# Altium project RyuBoard v2.0.PrjPcb
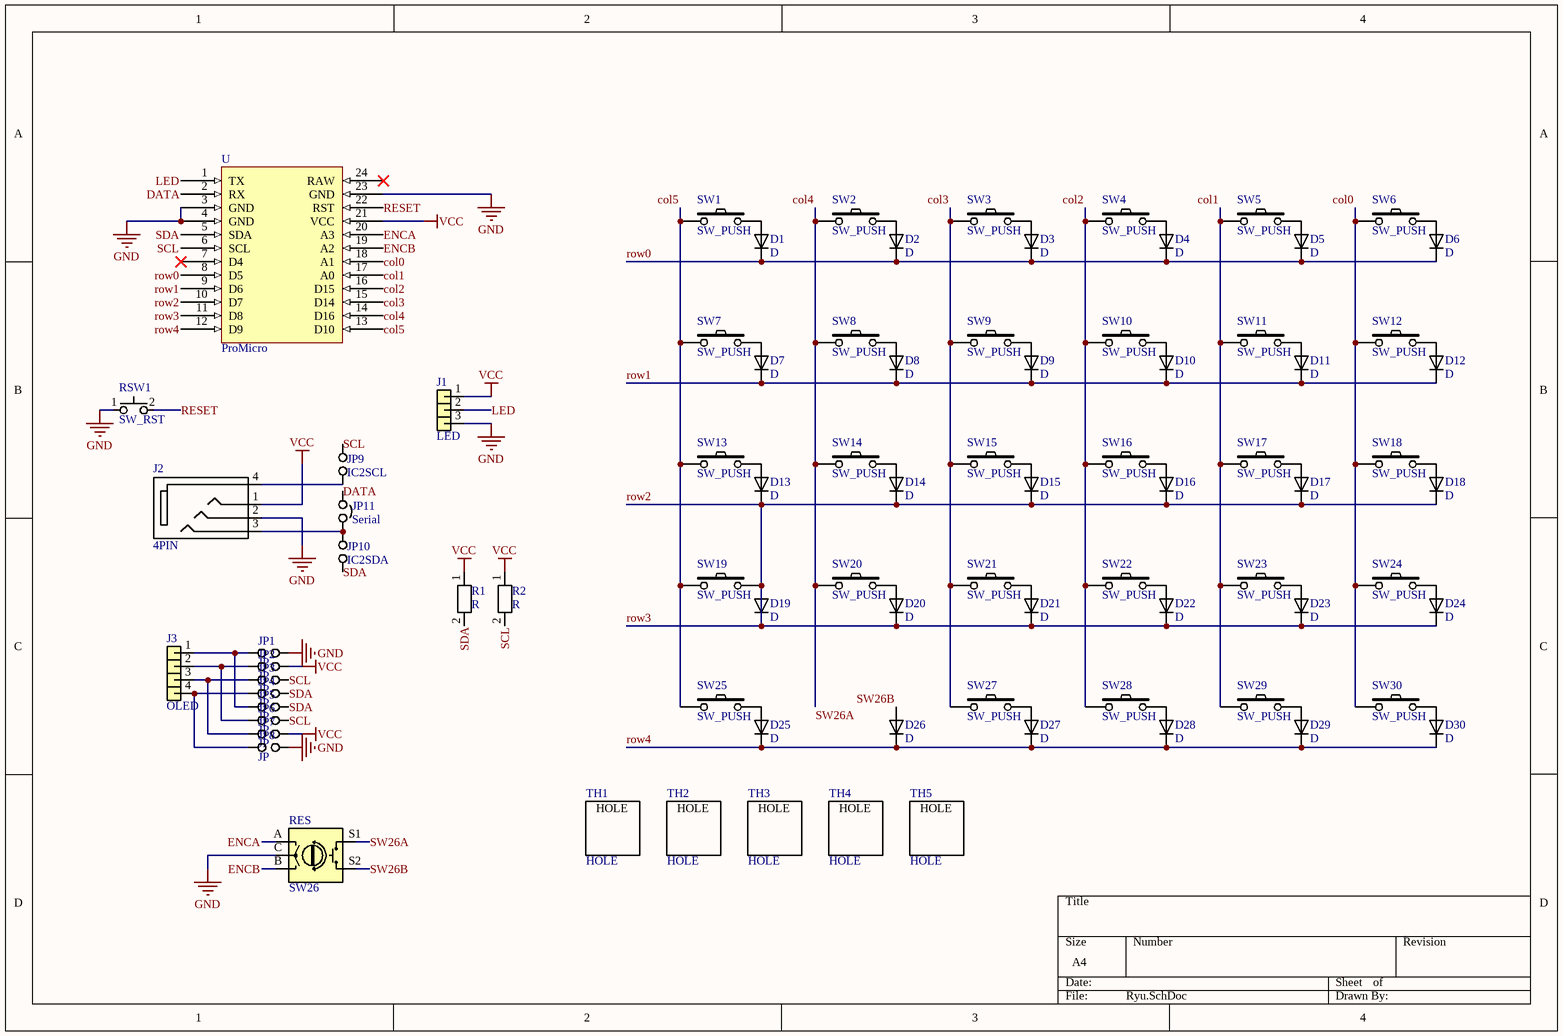
[diagram p0: Ryu.SchDoc]
1 sheet, 83 parts. Net scope: global (net labels, ports and power ports of the same name join across sheets).
Board file: Ryu.PcbDoc

## Sheet Ryu.SchDoc
size A4; SheetNumber: 1; SheetTotal: 1

### Parts
D1  D  [D_SOD123]
D2  D  [D_SOD123]
D3  D  [D_SOD123]
D4  D  [D_SOD123]
D5  D  [D_SOD123]
D6  D  [D_SOD123]
D7  D  [D_SOD123]
D8  D  [D_SOD123]
D9  D  [D_SOD123]
D10  D  [D_SOD123]
D11  D  [D_SOD123]
D12  D  [D_SOD123]
D13  D  [D_SOD123]
D14  D  [D_SOD123]
D15  D  [D_SOD123]
D16  D  [D_SOD123]
D17  D  [D_SOD123]
D18  D  [D_SOD123]
D19  D  [D_SOD123]
D20  D  [D_SOD123]
D21  D  [D_SOD123]
D22  D  [D_SOD123]
D23  D  [D_SOD123]
D24  D  [D_SOD123]
D25  D  [D_SOD123]
D26  D  [D_SOD123]
D27  D  [D_SOD123]
D28  D  [D_SOD123]
D29  D  [D_SOD123]
D30  D  [D_SOD123]
J1  LED  [LED]
J2  4PIN  [TRRS]
J3  OLED  [OLED]
JP1  JP  [JUMPER]
JP2  JP  [JUMPER]
JP3  JP  [JUMPER]
JP4  JP  [JUMPER]
JP5  JP  [JUMPER]
JP6  JP  [JUMPER]
JP7  JP  [JUMPER]
JP8  JP  [JUMPER]
JP9  IC2SCL  [JUMPER_Triangle]
JP10  IC2SDA  [JUMPER_Triangle]
JP11  Serial  [JUMPER_DATA]
R1  R  [RESISTOR]
R2  R  [RESISTOR]
RES  SW26  [Rotary_Encoder_Alps]
RSW1  SW_RST  [RST_SWITCH]
SW1  SW_PUSH  [1u-CherryMX-Hotswap-Dualside]
SW2  SW_PUSH  [1u-CherryMX-Hotswap-Dualside]
SW3  SW_PUSH  [1u-CherryMX-Hotswap-Dualside]
SW4  SW_PUSH  [1u-CherryMX-Hotswap-Dualside]
SW5  SW_PUSH  [1u-CherryMX-Hotswap-Dualside]
SW6  SW_PUSH  [1.5u-CHERRYmx-hotswap-dualside]
SW7  SW_PUSH  [1u-CherryMX-Hotswap-Dualside]
SW8  SW_PUSH  [1u-CherryMX-Hotswap-Dualside]
SW9  SW_PUSH  [1u-CherryMX-Hotswap-Dualside]
SW10  SW_PUSH  [1u-CherryMX-Hotswap-Dualside]
SW11  SW_PUSH  [1u-CherryMX-Hotswap-Dualside]
SW12  SW_PUSH  [1.5u-CHERRYmx-hotswap-dualside]
SW13  SW_PUSH  [1u-CherryMX-Hotswap-Dualside]
SW14  SW_PUSH  [1u-CherryMX-Hotswap-Dualside]
SW15  SW_PUSH  [1u-CherryMX-Hotswap-Dualside]
SW16  SW_PUSH  [1u-CherryMX-Hotswap-Dualside]
SW17  SW_PUSH  [1u-CherryMX-Hotswap-Dualside]
SW18  SW_PUSH  [1.5u-CHERRYmx-hotswap-dualside]
SW19  SW_PUSH  [1u-CherryMX-Hotswap-Dualside]
SW20  SW_PUSH  [1u-CherryMX-Hotswap-Dualside]
SW21  SW_PUSH  [1u-CherryMX-Hotswap-Dualside]
SW22  SW_PUSH  [1u-CherryMX-Hotswap-Dualside]
SW23  SW_PUSH  [1u-CherryMX-Hotswap-Dualside]
SW24  SW_PUSH  [1.5u-CHERRYmx-hotswap-dualside]
SW25  SW_PUSH  [1u-CherryMX-Hotswap-Dualside]
SW27  SW_PUSH  [1.5u-CHERRYmx-hotswap-dualside]
SW28  SW_PUSH  [1u-CherryMX-Hotswap-Dualside]
SW29  SW_PUSH  [1u-CherryMX-Hotswap-Dualside]
SW30  SW_PUSH  [1u-CherryMX-Hotswap-Dualside]
TH1  HOLE  [M2_TH_HOLE]
TH2  HOLE  [M2_TH_HOLE]
TH3  HOLE  [M2_TH_HOLE]
TH4  HOLE  [M2_TH_HOLE]
TH5  HOLE  [M2_TH_HOLE]
U  ProMicro  [ProMicro]

### Nets
GND: J1.3 J2.2 JP1.J2 JP8.J2 RES.C(B) RSW1.1 U.3(GND) U.4(GND) U.23(GND)
VCC: J1.1 J2.1 JP2.J2 JP7.J2 R1.1 R2.1 U.21(VCC)
col0: SW6.1 SW12.1 SW18.1 SW24.1 SW30.1 U.18(A1)
col1: SW5.1 SW11.1 SW17.1 SW23.1 SW29.1 U.17(A0)
col2: SW4.1 SW10.1 SW16.1 SW22.1 SW28.1 U.16(D15)
col3: SW3.1 SW9.1 SW15.1 SW21.1 SW27.1 U.15(D14)
col4: RES.S1 SW2.1 SW8.1 SW14.1 SW20.1 U.14(D16)  [also labelled SW26A]
col5: SW1.1 SW7.1 SW13.1 SW19.1 SW25.1 U.13(D10)
DATA: JP11.J1 U.2(RX)
ENCA: RES.A U.20(A3)
ENCB: RES.B(C) U.19(A2)
LED: J1.2 U.1(TX)
RESET: RSW1.2 U.22(RST)
row0: D1.1(K) D2.1(K) D3.1(K) D4.1(K) D5.1(K) D6.1(K) U.8(D5)
row1: D7.1(K) D8.1(K) D9.1(K) D10.1(K) D11.1(K) D12.1(K) U.9(D6)
row2: D13.1(K) D14.1(K) D15.1(K) D16.1(K) D17.1(K) D18.1(K) D19.1(K) D19.2(A) D20.1(K) D21.1(K) D22.1(K) D23.1(K) D24.1(K) SW19.2 U.10(D7) U.11(D8)  [also labelled row3]
row4: D25.1(K) D26.1(K) D27.1(K) D28.1(K) D29.1(K) D30.1(K) U.12(D9)
SCL: JP3.J2 JP6.J2 JP9.J2 R2.2 U.6(SCL)
SDA: JP4.J2 JP5.J2 JP10.J2 R1.2 U.5(SDA)
SW26B: D26.2(A) RES.S2
NetD1_2: D1.2(A) SW1.2
NetD2_2: D2.2(A) SW2.2
NetD3_2: D3.2(A) SW3.2
NetD4_2: D4.2(A) SW4.2
NetD5_2: D5.2(A) SW5.2
NetD6_2: D6.2(A) SW6.2
NetD7_2: D7.2(A) SW7.2
NetD8_2: D8.2(A) SW8.2
NetD9_2: D9.2(A) SW9.2
NetD10_2: D10.2(A) SW10.2
NetD11_2: D11.2(A) SW11.2
NetD12_2: D12.2(A) SW12.2
NetD13_2: D13.2(A) SW13.2
NetD14_2: D14.2(A) SW14.2
NetD15_2: D15.2(A) SW15.2
NetD16_2: D16.2(A) SW16.2
NetD17_2: D17.2(A) SW17.2
NetD18_2: D18.2(A) SW18.2
NetD20_2: D20.2(A) SW20.2
NetD21_2: D21.2(A) SW21.2
NetD22_2: D22.2(A) SW22.2
NetD23_2: D23.2(A) SW23.2
NetD24_2: D24.2(A) SW24.2
NetD25_2: D25.2(A) SW25.2
NetD27_2: D27.2(A) SW27.2
NetD28_2: D28.2(A) SW28.2
NetD29_2: D29.2(A) SW29.2
NetD30_2: D30.2(A) SW30.2
NetJ2_3: J2.3 JP10.J1 JP11.J2
NetJ2_4: J2.4 JP9.J1
NetJ3_1: J3.1 JP1.J1 JP5.J1
NetJ3_2: J3.2 JP2.J1 JP6.J1
NetJ3_3: J3.3 JP3.J1 JP7.J1
NetJ3_4: J3.4 JP4.J1 JP8.J1

Not connected (* = marked no-connect by the designer): U 7(D4)* 24(RAW)*

### Library data of the parts
JP9 JP10 = JP
JP11 = JP_C
RES = SW